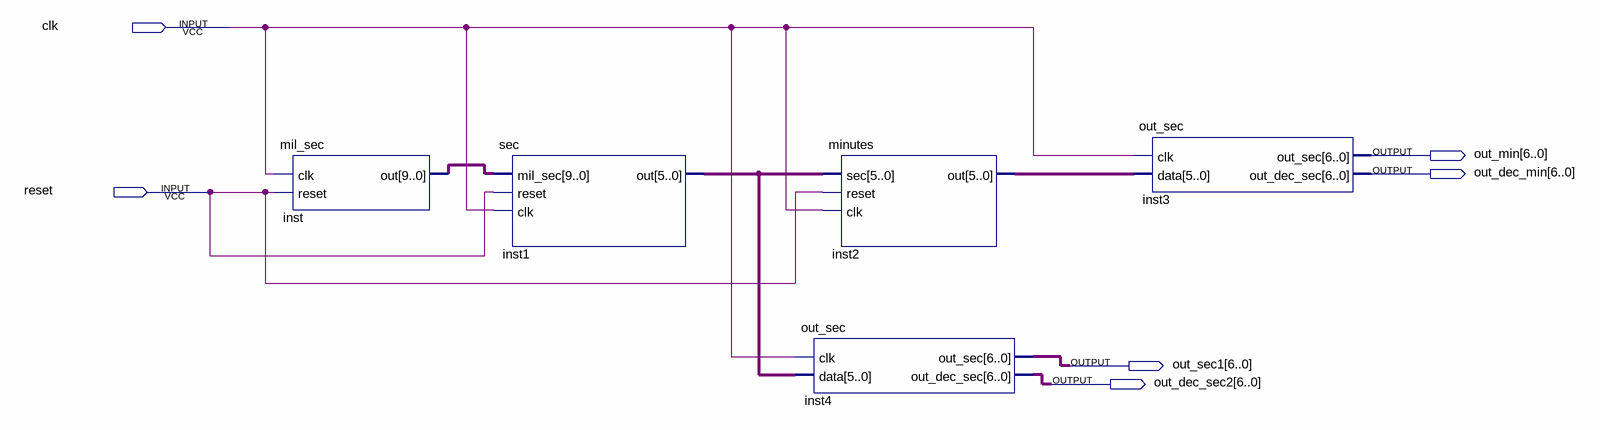
[diagram p0: schematic sheet]
// Quartus schematic Block1.bdf as structural Verilog: 5 symbols, 6 pins
module Block1 (
  input  clk,
  input  reset,
  output [6:0] out_min,
  output [6:0] out_dec_min,
  output [6:0] out_sec1,
  output [6:0] out_dec_sec2
);

  wire [5:0] inst1_out, inst2_out;
  wire [9:0] inst_out;

  mil_sec inst (.clk(clk), .reset(reset), .out(inst_out));
  sec inst1 (.mil_sec(inst_out), .reset(reset), .clk(clk), .out(inst1_out));
  minutes inst2 (.sec(inst1_out), .reset(reset), .clk(clk), .out(inst2_out));
  out_sec inst4 (.clk(clk), .data(inst1_out), .out_sec(out_sec1), .out_dec_sec(out_dec_sec2));
  out_sec inst3 (.clk(clk), .data(inst2_out), .out_sec(out_min), .out_dec_sec(out_dec_min));
endmodule
